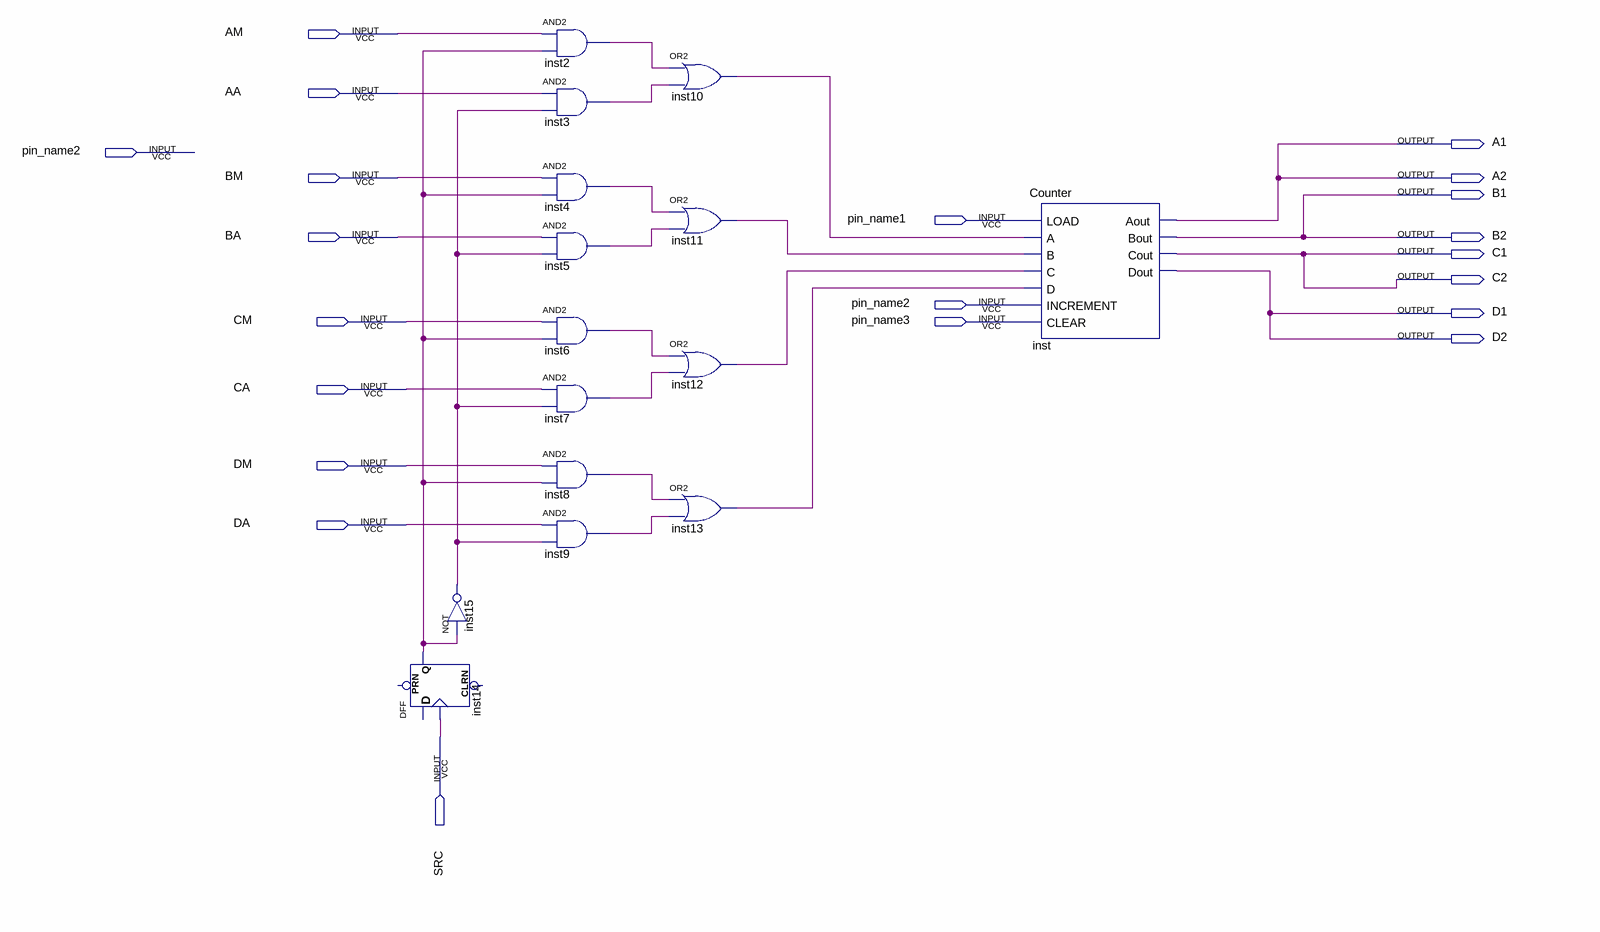
[diagram p0: schematic sheet]
// Quartus schematic Block1.bdf as structural Verilog: 15 symbols, 21 pins
module Block1 (
  input  AM,
  input  AA,
  input  pin_name2,
  input  BM,
  input  pin_name1,
  input  BA,
  input  CM,
  input  pin_name3,
  input  CA,
  input  DM,
  input  DA,
  input  SRC,
  output A1,
  output A2,
  output B1,
  output B2,
  output C1,
  output C2,
  output D1,
  output D2
);

  wire inst2_out, inst3_out, inst4_out, inst5_out, inst6_out, inst7_out, inst8_out, inst9_out, inst10_out,
       inst11_out, inst12_out, inst13_out, inst14_q, inst15_out;

  not inst15 (inst15_out, inst14_q);
  DFF inst14 (.CLK(SRC), .Q(inst14_q));  // open: CLRN, D, PRN
  and inst2 (inst2_out, AM, inst14_q);
  and inst3 (inst3_out, AA, inst15_out);
  and inst4 (inst4_out, BM, inst14_q);
  and inst5 (inst5_out, BA, inst15_out);
  and inst6 (inst6_out, CM, inst14_q);
  and inst7 (inst7_out, CA, inst15_out);
  and inst8 (inst8_out, DM, inst14_q);
  and inst9 (inst9_out, DA, inst15_out);
  or inst10 (inst10_out, inst2_out, inst3_out);
  or inst11 (inst11_out, inst4_out, inst5_out);
  or inst12 (inst12_out, inst6_out, inst7_out);
  or inst13 (inst13_out, inst8_out, inst9_out);
  Counter inst (
    .LOAD(pin_name1), .A(inst10_out), .B(inst11_out), .C(inst12_out), .D(inst13_out), .INCREMENT(pin_name2),
    .CLEAR(pin_name3), .Aout(A1), .Bout(B1), .Cout(C1), .Dout(D1));

  assign A2 = A1;
  assign B2 = B1;
  assign C2 = C1;
  assign D2 = D1;
endmodule
